# Altium schematic sheet ENABLE.SchDoc
size A4
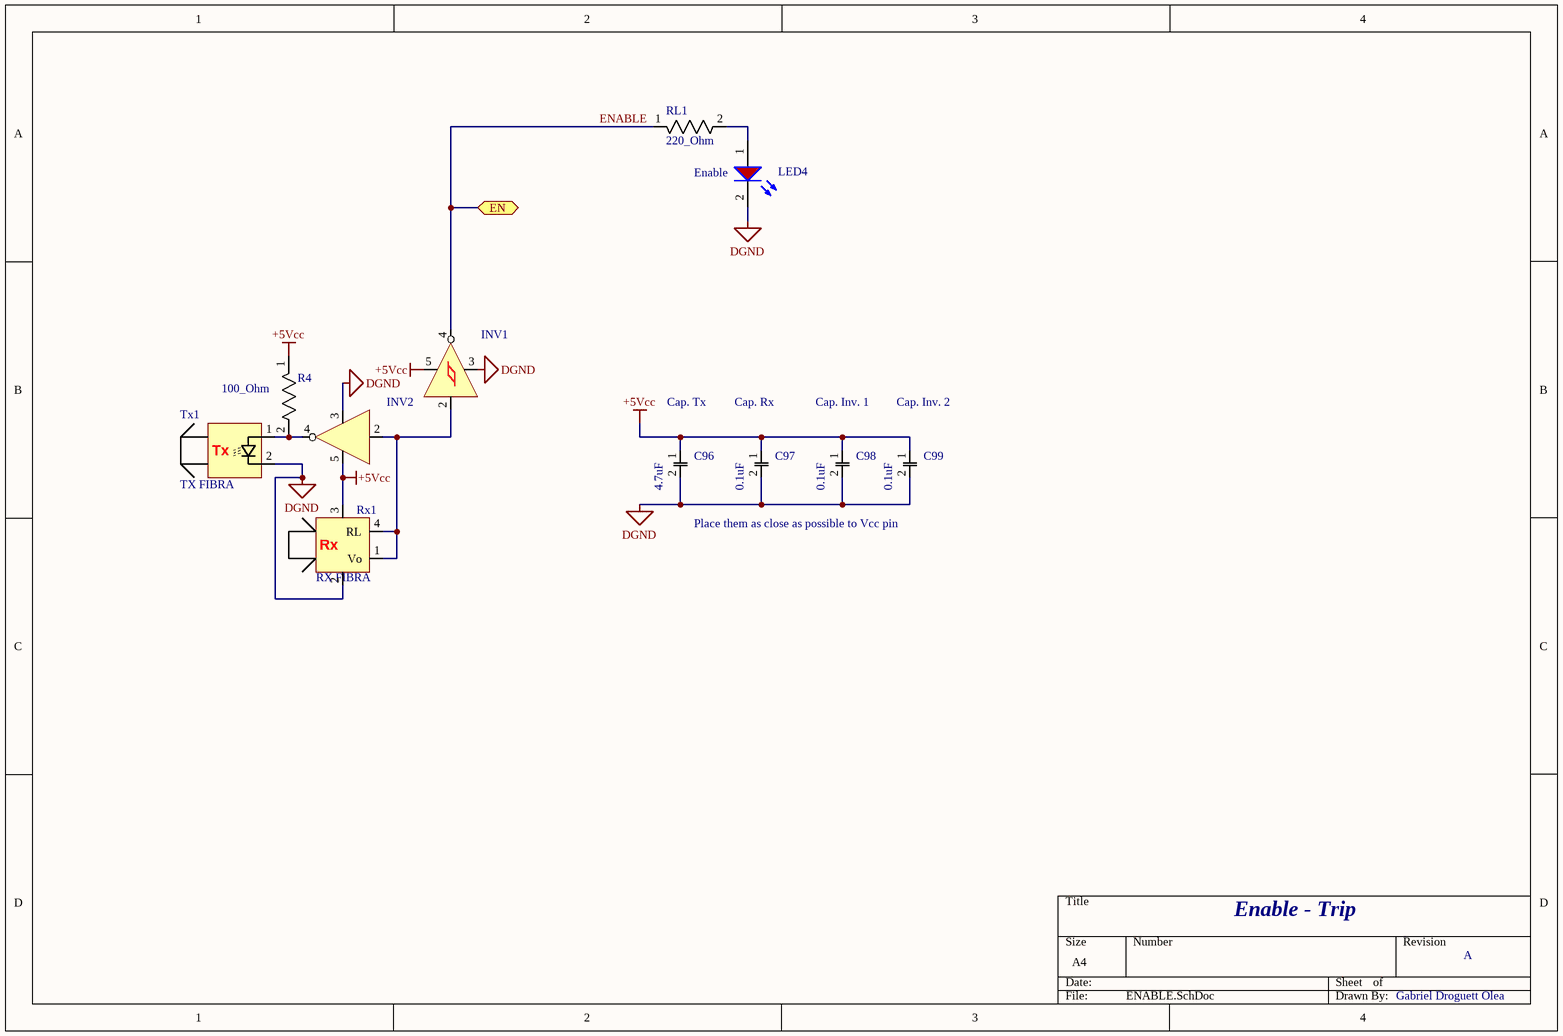
[diagram p0: ENABLE.SchDoc]

## Parts
C96  4.7uF  [CAP_0603]
C97  0.1uF  [CAP_0603]
C98  0.1uF  [CAP_0603]
C99  0.1uF  [CAP_0603]
INV1  NOT SCHMITT  [INV_SN74AHC1G14DBVR]  (value not drawn)
INV2  NOT OPEN COLLECTOR  [INV_SN74LVC1G06DBVR]  (value not drawn)
LED4  Enable  [LED_0805]
R4  100_Ohm  [RES_0805]
RL1  220_Ohm  [res_0805]
Rx1  RX FIBRA  [Rx_HFBR-2521Z]
Tx1  TX FIBRA  [Tx_HFBR-1521Z]

## Ports
EN (bidir)

## Nets
+5Vcc: C96.1 C97.1 C98.1 C99.1 INV1.5(Vcc) INV2.5(Vcc) R4.1(C) Rx1.3(Vcc)
DGND: C96.2 C97.2 C98.2 C99.2 INV1.3(GND) INV2.3(GND) LED4.2(C) Rx1.2(GND) Tx1.2(Catodo)
ENABLE: INV1.4(Vcc) RL1.1(C) ; port EN
NetINV1_2: INV1.2(A) INV2.2(A) Rx1.1(Vo) Rx1.4(RL)
NetINV2_4: INV2.4(Vcc) R4.2(A) Tx1.1(Anodo)
NetLED4_1: LED4.1(A) RL1.2(A)

Not connected (* = marked no-connect by the designer): INV1 1(NC); INV2 1; Rx1 5(NC) 8(NC); Tx1 3(NC) 4(NC) 5(NC) 8(NC)

## Notes on the sheet
- Cap. Tx
- Cap. Rx
- Cap. Inv. 1
- Cap. Inv. 2
- Place them as close as possible to Vcc pin
- Enable - Trip
- A
- Gabriel Droguett Olea
- (in symbol Rx_HFBR-2521Z) Rx
- (in symbol Tx_HFBR-1521Z) Tx

## Library data of the parts
C96 = CAP_0603YC104KAT2A: 4.7µF ±20% 6.3V Ceramic Capacitor X5R 0603 (1608 Metric); Manufacturer Part Number: 885012106005; Digi-Key Part Number: 732-7902-1-ND; RS Part Number: 839-2990
C97-C99 = CAP_0603YC104KAT2A: 0.1µF ±10% 16V Ceramic Capacitor X7R 0603 (1608 Metric); Digi-Key Part Number: 478-1239-1-ND; Manufacturer Part Number: 0603YC104KAT2A; RS Part Number: *
INV1 = INV_SN74AHC1G14DBVR: IC SCHMITT-TRG INV GATE SOT23-5; Digi-Key Part Number: 296-1092-1-ND; Manufacturer Part Number: SN74AHC1G14DBVR; RS Part Number: *
INV2 = INV_SN74LVC1G06DBVR: IC INVERTER SGL 1INPUT SOT23-5; Digi-Key Part Number: 296-8483-1-ND; Manufacturer Part Number: SN74LVC1G06DBVR; RS Part Number: 809-5952
LED4 = WL-SMCW 0805  150080RS75000: LED YELLOW CLEAR 0805 SMD; Manufacturer Part Number: 150080YS75000; Digi-Key Part Number: 732-4987-1-ND; RS Part Number: 815-4228
R4 = RES100_RPC0805JT100R: RES 100 OHM 5% 1/4W 0805; Digi-Key Part Number: RPC0805JT100RCT-ND; Manufacturer Part Number: RPC0805JT100R; RS Part Number: *
RL1 = RES_ERJ-3GEYJ471V: 1% 1/4W 0805; Manufacturer Part Number: RC0603FR-07220RL; Digi-Key Part Number: 311-220HRCT-ND; RS Part Number: *
Rx1 = Rx_HFBR-2521Z: RECEIVER FIBER OPTIC 600NM 5MBD; Digi-Key Part Number: 516-2062-ND; Manufacturer Part Number: HFBR-2521Z; RS Part Number: 446-150
Tx1 = Tx_HFBR-1521Z: XMITTER FIBER OPTIC 600NM 5MBD; Digi-Key Part Number: 516-2043-ND; Manufacturer Part Number: HFBR-1521Z; RS Part Number: 171-1600